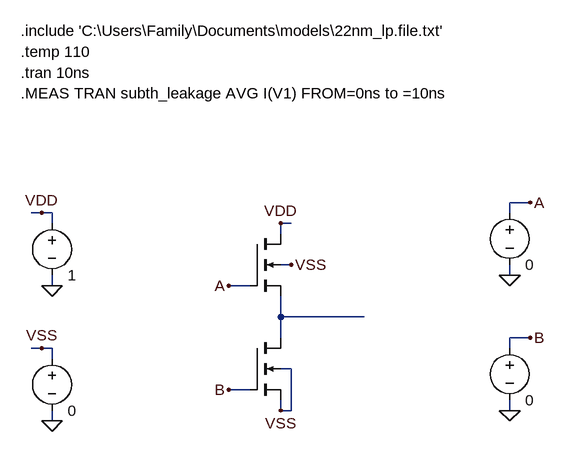
[diagram p0: schematic HW4 Q1 part A.asc]
HW4 Q1 part A.asc, the LTspice schematic file:
Version 4
SHEET 1 880 680
WIRE 464 288 432 288
WIRE -288 304 -304 304
WIRE -272 304 -288 304
WIRE 432 304 432 288
WIRE -272 320 -272 304
WIRE 96 320 80 320
WIRE 80 336 80 320
WIRE 96 384 80 384
WIRE 432 400 432 384
WIRE -272 416 -272 400
WIRE 32 416 0 416
WIRE 80 464 80 432
WIRE 208 464 80 464
WIRE 80 496 80 464
WIRE 464 496 432 496
WIRE -288 512 -304 512
WIRE -272 512 -288 512
WIRE 432 512 432 496
WIRE -272 528 -272 512
WIRE 96 544 80 544
WIRE 32 576 0 576
WIRE 80 608 80 592
WIRE 96 608 96 544
WIRE 96 608 80 608
WIRE 432 608 432 592
WIRE -272 624 -272 608
FLAG -272 416 0
FLAG -272 624 0
FLAG -288 304 VDD
FLAG -288 512 VSS
FLAG 0 416 A
FLAG 0 576 B
FLAG 80 320 VDD
FLAG 80 608 VSS
FLAG 96 384 VSS
FLAG 432 400 0
FLAG 432 608 0
FLAG 464 288 A
FLAG 464 496 B
SYMBOL nmos4 32 336 R0
WINDOW 0 56 32 Invisible 2
WINDOW 3 56 72 Invisible 2
SYMATTR InstName M1
SYMATTR Value2 l=0.03u w=1u
SYMBOL nmos4 32 496 R0
WINDOW 0 56 32 Invisible 2
WINDOW 3 56 72 Invisible 2
SYMATTR InstName M2
SYMATTR Value2 l=0.03u w=1u
SYMBOL voltage -272 304 R0
WINDOW 0 24 16 Invisible 2
SYMATTR InstName V1
SYMATTR Value 1
SYMBOL voltage -272 512 R0
WINDOW 0 24 16 Invisible 2
SYMATTR InstName V2
SYMATTR Value 0
SYMBOL voltage 432 288 R0
WINDOW 0 24 16 Invisible 2
WINDOW 123 0 0 Left 2
WINDOW 39 0 0 Left 2
SYMATTR InstName V3
SYMATTR Value 0
SYMBOL voltage 432 496 R0
WINDOW 0 24 16 Invisible 2
WINDOW 123 0 0 Left 2
WINDOW 39 0 0 Left 2
SYMATTR InstName V4
SYMATTR Value 0
TEXT -320 24 Left 2 !.include 'C:\\Users\\Family\\Documents\\models\\22nm_lp.file.txt'
TEXT -320 56 Left 2 !.temp 110
TEXT -320 88 Left 2 !.tran 10ns
TEXT -320 120 Left 2 !.MEAS TRAN subth_leakage AVG I(V1) FROM=0ns to =10ns

The netlist it stands for:
* HW4 Q1 part A.asc
M1 VDD A N001 VSS NMOS l=0.03u w=1u
M2 N001 B VSS VSS NMOS l=0.03u w=1u
V1 VDD 0 1
V2 VSS 0 0
V3 A 0 0
V4 B 0 0
.model NMOS NMOS
.model PMOS PMOS
.lib standard.mos
.include 'C:\Users\Family\Documents\models\22nm_lp.file.txt'
.temp 110
.tran 10ns
.MEAS TRAN subth_leakage AVG I(V1) FROM=0ns to =10ns
.backanno
.end